# EAGLE design Doorbell (EAGLE 9.6.2)
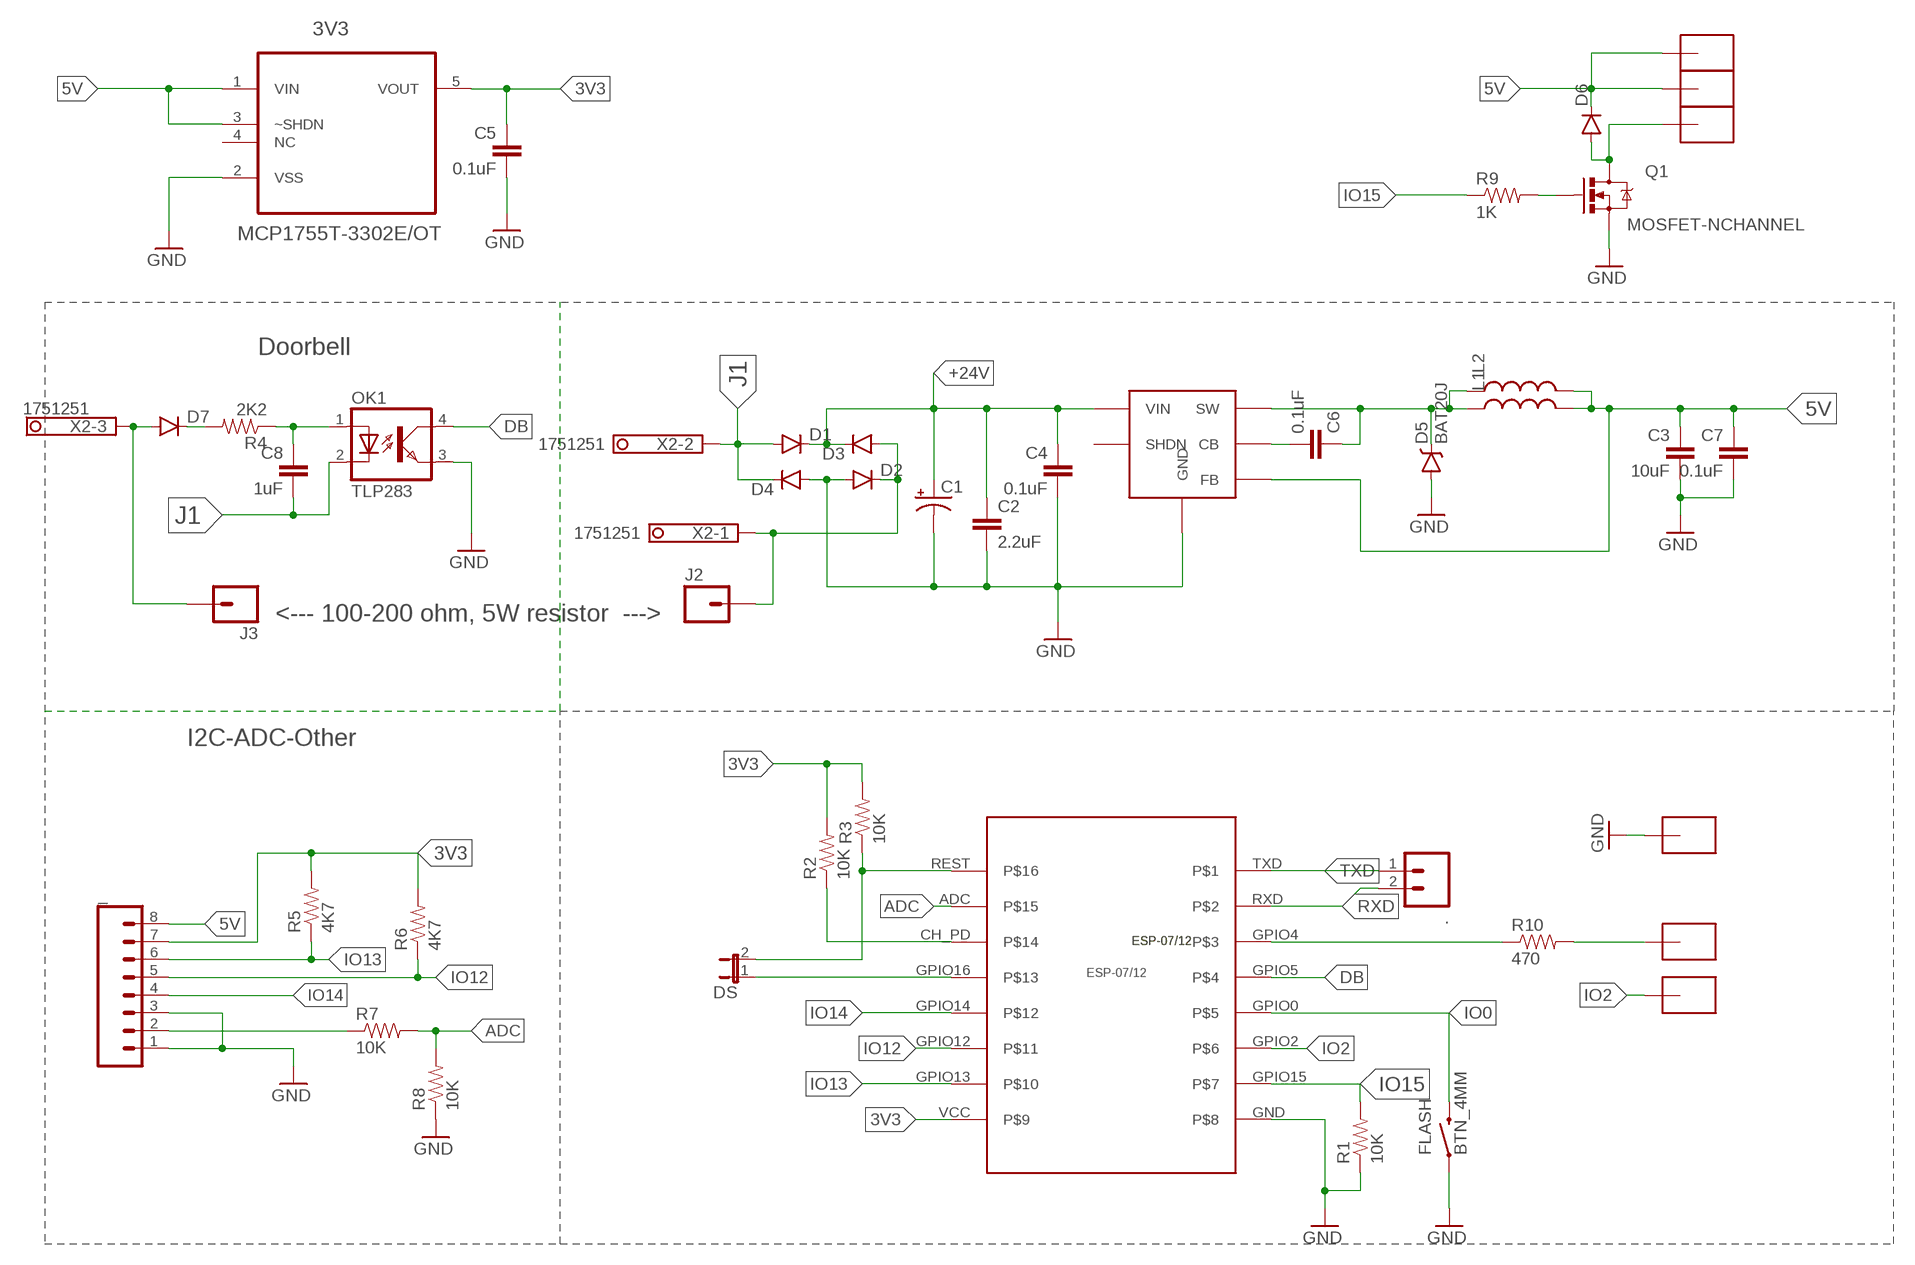
[diagram p0: schematic, sheet 1]

## Parts
3V3  MCP1755T-3302E/OT  MCP1801T-3302I/OT  [SOT95P270X145-5N]
.  M02PTH  [1X02]
_  M08SILK_FEMALE_PTH  [1X08]
C1  CAP_POLPTH4  [CPOL-RADIAL-1000UF-25V]
C2  2.2uF  CAP1206  [1206]
C3  10uF  CAP  [0805-CAP]
C4  0.1uF  CAP  [0805-CAP]
C5  0.1uF  CAP  [0805-CAP]
C6  0.1uF  CAP  [0805-CAP]
C7  0.1uF  CAP  [0805-CAP]
C8  1uF  CAP  [0805-CAP]
D1  DIODESOD123  [SOD-123]
D2  DIODESOD123  [SOD-123]
D3  DIODESOD123  [SOD-123]
D4  DIODESOD123  [SOD-123]
D5  BAT20J  DIODE-SCHOTTKY-BAT20J  [SOD-323]
D6  DIODESOD123  [SOD-123]
D7  DIODESOD123  [SOD-123]
DS  JUMPER-2SMD-NO  [SJ_2S-NO]
FLASH  BTN_4MM  [BTN_4MM]
J2  M01SMDNS  [1X01NS]
J3  M01SMDNS  [1X01NS]
L1  INDUCTOR0805  [0805]
L2  INDUCTOR0805  [0805]
OK1  TLP283  [MINI-FLAT-4]
Q1  MOSFET-NCHANNEL  MOSFET-NCHANNELAO3404A  [SOT23-3]
R1  10K  RESISTOR0805-RES  [0805]
R2  10K  RESISTOR0805-RES  [0805]
R3  10K  RESISTOR0805-RES  [0805]
R4  2K2  RESISTOR0805-RES  [0805]
R5  4K7  RESISTOR0805-RES  [0805]
R6  4K7  RESISTOR0805-RES  [0805]
R7  10K  RESISTOR0805-RES  [0805]
R8  10K  RESISTOR0805-RES  [0805]
R9  1K  RESISTOR0805-RES  [0805]
R10  470  RESISTOR0805-RES  [0805]
U$1  ESP-07/12  [ESP-07/12]
U$2  SMD-PAD-SM  [SMD-PAD3]
U$3  SMD-PAD-SM  [SMD-PAD3]
U$4  SMD-PAD-SM  [SMD-PAD3]
U$5  SMD-PAD-SM  [SMD-PAD3]
U$6  SMD-PAD-SM  [SMD-PAD3]
U$7  SMD-PAD-SM  [SMD-PAD3]
VREG  LMR16006YQ5DDCRQ1  LMR16006YQ  [SOT-23-6]
X2  1751251  [1751251]

## Nets
3V3: 3V3.5(VOUT) _.7 C5.1 R2.2 R3.2 R5.2 R6.2 U$1.VCC
5V: 3V3.1(VIN) 3V3.3(~SHDN) _.8 C3.1 C7.1 D6.C L1.2 L2.2 U$3.P$1 U$7.P$1 VREG.3(FB)
+24V: C1.+ C2.1 C4.1 D1.C D3.C VREG.5(VIN)
ADC: R7.2 R8.2 U$1.ADC
DB: OK1.4(COL) U$1.GPIO5
GND: 3V3.2(VSS) _.1 _.3 C1.- C2.2 C3.2 C4.2 C5.2 C7.2 D2.A D4.A D5.A FLASH.1 OK1.3(EMIT) Q1.2(S) R1.1 R8.1 U$1.GND U$4.P$1 VREG.2(GND)
ICSPCLK: DS.2 R3.1 U$1.REST
IO0: FLASH.2 U$1.GPIO0
IO2: U$1.GPIO2 U$5.P$1
IO12: _.5 R6.1 U$1.GPIO12
IO13: _.6 R5.1 U$1.GPIO13
IO14: _.4 U$1.GPIO14
IO15: R1.2 R9.1 U$1.GPIO15
IO16: DS.1 U$1.GPIO16
J1: C8.2 D1.A D4.C OK1.2(C) X2.2
N$1: D6.A Q1.3(D) U$6.P$1
N$2: C8.1 OK1.1(A) R4.1
N$3: D2.C D3.A J2.1 X2.1
N$4: _.2 R7.1
N$5: D7.A J3.1 X2.3
N$6: R10.1 U$1.GPIO4
N$7: C6.1 D5.C L1.1 L2.1 VREG.6(SW)
N$8: Q1.1(G) R9.2
N$10: C6.2 VREG.1(CB)
N$11: R2.1 U$1.CH_PD
N$12: R10.2 U$2.P$1
N$13: D7.C R4.2
RXD: ..2 U$1.RXD
TXD: ..1 U$1.TXD
Unconnected: 3V3.4(NC) VREG.4(SHDN)

## Notes on the sheet
- Doorbell
- <--- 100-200 ohm, 5W resistor  --->
- I2C-ADC-Other

## Library data of the parts
3V3 = Microchip_By_element14_Batch_1:MCP1801T-3302I/OT: Low Quiescent Current LDO; MPN: MCP1801T-3302I/OT; OC_FARNELL: 1578370; OC_NEWARK: 54M4830; PACKAGE: SOT-5; SUPPLIER: Microchip
. = SparkFun-Connectors:M02: Standard 2-pin 0.1" header. Use with - straight break away headers ( PRT-00116) - right angle break away headers (PRT-00553) - swiss pins (PRT-00743) - machine pins (PRT-00117) - female headers (PRT-00115) Molex polarized connector foot print use with: PRT-08233 with associated crimp pins and housings. 2.54_SCREWTERM for use with PRT-10571. 3.5mm Screw Terminal footprints for PRT-08084 5mm Screw Terminal footprints for use with PRT-08432
_ = SparkFun-Connectors:M08: Header 8 Standard 8-pin 0.1" header. Use with straight break away headers (SKU : PRT-00116), right angle break away headers (PRT-00553), swiss pins (PRT-00743), machine pins (PRT-00117), and female headers (PRT-00115).; PROD_ID: CONN-08438
C1 = SparkFun-Capacitors:CAP_POL: Capacitor Polarized These are standard SMD and PTH capacitors. Normally 10uF, 47uF, and 100uF in electrolytic and tantalum varieties. Always verify the external diameter of the through hole cap, it varies with capacity, voltage, and manufacturer. The EIA devices should be standard.
C2 = SparkFun-Passives:CAP: Capacitor Standard 0603 ceramic capacitor, and 0.1" leaded capacitor.
C3-C8 = SparkFun-Capacitors:CAP: Capacitor Standard 0603 ceramic capacitor, and 0.1" leaded capacitor.
D1-D4 D6 D7 = SparkFun-DiscreteSemi:DIODE: Diode These are standard reverse protection diodes and small signal diodes. SMA package can handle up to about 1A. SOD-323 can handle about 200mA. What the SOD-323 package when ordering, there are some mfgs out there that are 5-pin packages.
D5 = SparkFun-DiscreteSemi:DIODE-SCHOTTKY: Schottky diodes in SFE's production catalog BAT20J 1A 23V 0.62Vf RB751 120mA 40V 0.37Vf PMEG4005EJ 0.5A 40V 0.42Vf MBRA140 1A 40V 0.5Vf B340A 3A 40V SMA; PROD_ID: DIO-11623
DS = SparkFun-Retired:JUMPER-2: Jumper Basic 0.1" spaced jumper. Use with breakaway headers.
FLASH = CuriousTech:BTN_4MM
J2 J3 = SparkFun-Connectors:M01: Header 1 Standard 1-pin 0.1" header. Use with straight break away headers (SKU : PRT-00116), right angle break away headers (PRT-00553), swiss pins (PRT-00743), machine pins (PRT-00117), and female headers (PRT-00115). SMTSO-256-ET is a "flush mount" nut for a 4-40 screw. The older package used to be too tight, and did not allow it to sit properly thru the drill hit. The latest (0.165DIA) fits nice and snug.
L1 L2 = SparkFun-Passives:INDUCTOR: Inductors Basic Inductor/Choke - 0603 and 1206. Footprints are not proven and vary greatly between part numbers. INDUCTOR POWER 3.3UH 4.0A SMD 0.197" L x 0.197" W x 0.177" H (5.00mm x 5.00mm x 4.50mm)
OK1 = optocoupler:TLP283: TOSHIBA PHOTOCOUPLER GaAs IRED & PHOTO-TRANSISTOR Source: http://www.semicon.toshiba.co.jp/td/en/Opto/Photocoupler/en_20050928_TLP283_datasheet.pdf; OC_FARNELL: unknown; OC_NEWARK: unknown
Q1 = SparkFun-DiscreteSemi:MOSFET-NCHANNEL: Common NMOSFET Parts MFG P/N Store ID Prod ID FDD8780 TRANS-09984 SI7820DN TRANS-11055 FDS6630A IC-08089 2N7002PW TRANS-11151 FQP30N06L COM-10213 TRANS-10060 BSS123LT1G TRANS-08345 BSS138 TRANS-00830 BS170 2N7000; PROD_ID: TRAN-12988
R1-R10 = SparkFun-Resistors:RESISTOR: Resistor Basic schematic elements and footprints for 0603, 1206, and PTH resistors.
U$1 = ESP-07_12:ESP-07/12: Version 1.0 of the library for the ESP-07/12 full GPIO dev board module byME Jon jonnyradu@gmail.com
U$2-U$7 = CuriousTech:SMD-PAD-SM: SMD-PAD
VREG = CuriousTech:LMR16006YQ
X2 = con-phoenix-350:1751251: MKDS 1/ 3-3,5 Printklemme Nennstrom: 10 A Bemessungsspannung: 160 V Raster: 3,5 mm Polzahl: 3 Montageart: Löten Anschlussart: Schraubanschluss Anschlussrichtung vom Leiter zur Platine: 0° Source: http://eshop.phoenixcontact.com .. 1751251.pdf; OC_FARNELL: unknown; OC_NEWARK: unknown

## Board
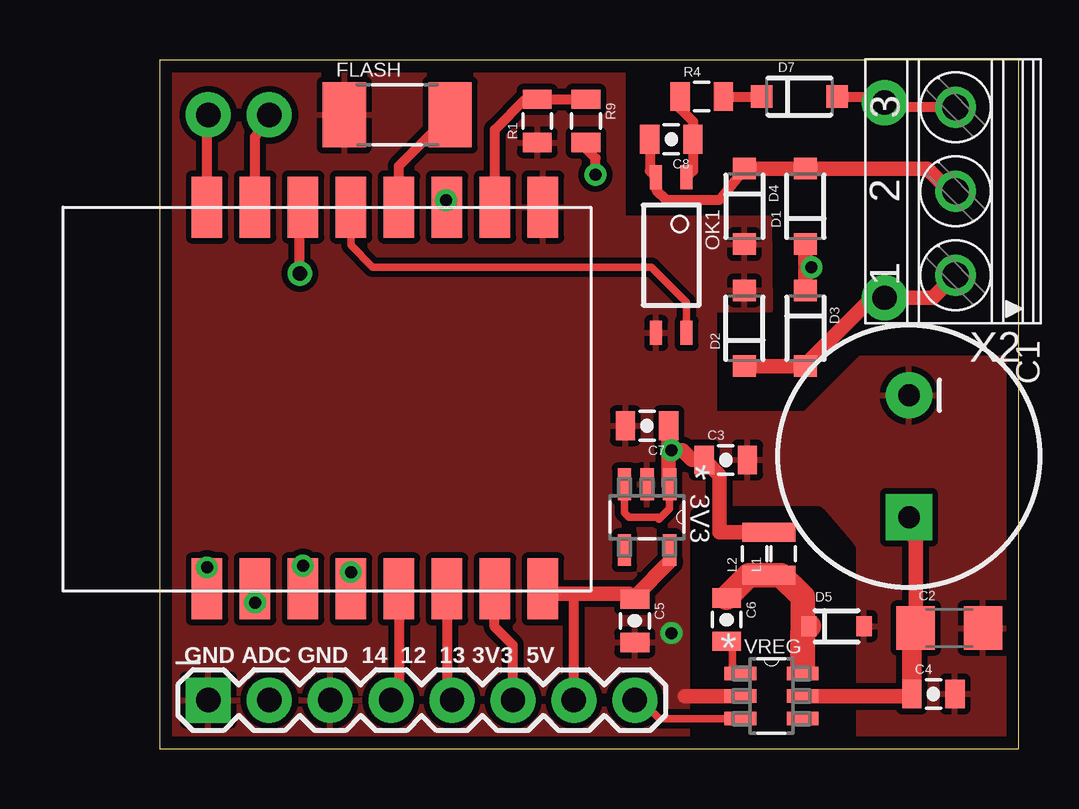
[diagram p1: board, top side]
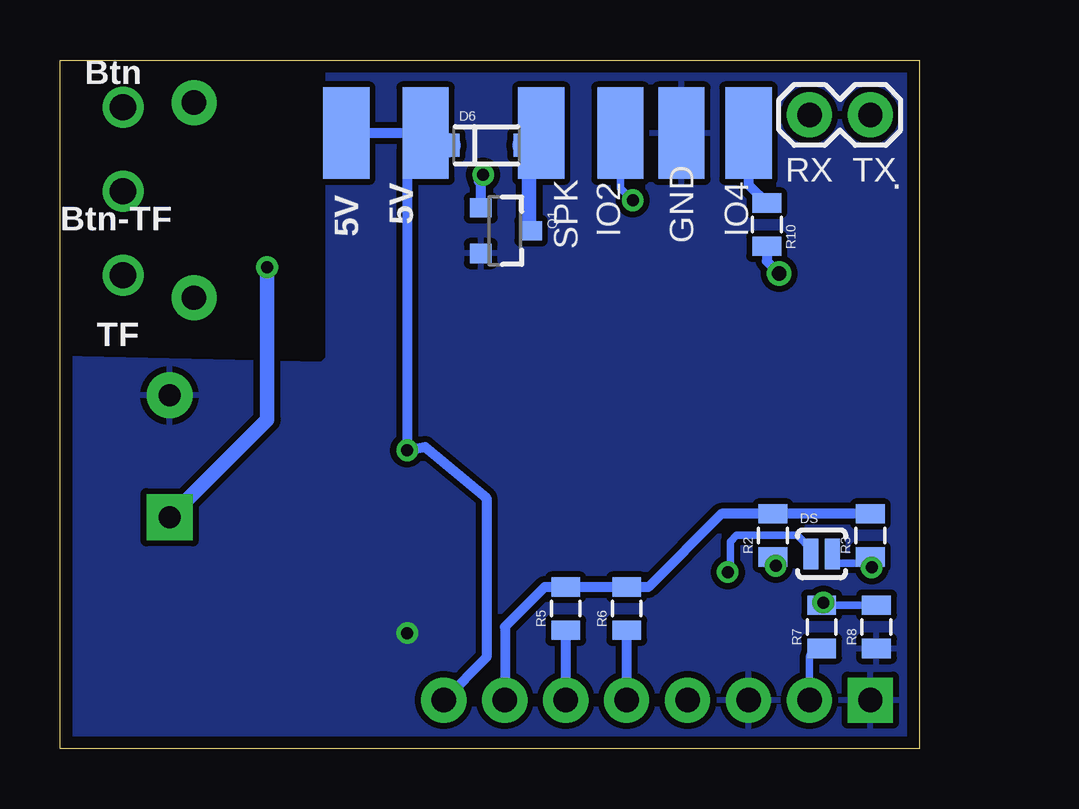
[diagram p2: board, bottom side, seen from below]

Size 35.81 x 28.7 mm. Coordinates in mm from the lower left corner, seen from the top.
Outline: 35.81,0 35.81,28.7 0,28.7 0,0 35.81,0
Copper layers (1*16): Top 0.035mm / dielectric 1.5mm / Bottom 0.035mm
Design rules "default *": minimum track width 10mil, minimum drill 24mil, track to track 8mil, track to pad 8mil, pad to pad 8mil, via to via 8mil, smd to smd 8mil, copper to edge 20mil, drill to drill 8mil, minimum pad ring 10mil, minimum via ring 8mil, stop-mask expansion 4mil, vias tented up to drill 0mil, thermal gap 10mil
tRestrict: area 22.5,0.5 to 28.6,9.7

### Footprints (pad centres in the part's own frame; a part is rotated, then mirrored left to right if it is on the bottom)
SOT95P270X145-5N = smd 1.321 x 0.559: 1 -1.372,0.94; 2 -1.372,0; 3 -1.372,-0.94; 4 1.372,-0.94; 5 1.372,0.94
1X02 = drill 1.016 pad 1.88: 1 0,0; 2 2.54,0
1X08 = drill 1.016 pad 1.88 square: 1 0,0 | drill 1.016 pad 1.88: 2 2.54,0; 3 5.08,0; 4 7.62,0; 5 10.16,0; 6 12.7,0; 7 15.24,0; 8 17.78,0
CPOL-RADIAL-1000UF-25V = drill 0.9 pad 1.93 square: + 2.54,0 | drill 0.9 pad 1.93: - -2.54,0
1206 = smd 1.6 x 1.8: 1 -1.4,0; 2 1.4,0
0805-CAP = smd 0.8 x 1.2: 1 -0.9,0; 2 0.9,0
SOD-123 = smd 0.9 x 0.95: A 1.575,0; C -1.575,0
SOD-323 = smd 0.63 x 0.83: A 1.15,0; C -1.15,0
SJ_2S-NO = smd 0.635 x 1.27: 1 -0.45,0; 2 0.45,0
BTN_4MM = smd 1.8 x 2.7: 1 -2.2,0; 2 2.2,0
1X01NS = drill 1.016 pad 1.88: 1 0,0
0805 = smd 0.8 x 1.2: 1 -0.9,0; 2 0.9,0
MINI-FLAT-4 = smd 1 x 0.5: 1 -3.24,0.635; 2 -3.24,-0.635; 3 3.24,-0.635; 4 3.24,0.635
SOT23-3 = smd 0.8 x 0.9: 1 -0.95,-1; 2 0.95,-1; 3 0,1.1
ESP-07/12 = smd 2.54 x 1.27: ADC 0.1,14; CH_PD 0.1,12; GND 16,2; GPIO0 16,8; GPIO2 16,6; GPIO4 16,12; GPIO5 16,10; GPIO12 0.1,6; GPIO13 0.1,4; GPIO14 0.1,8; GPIO15 16,4; GPIO16 0.1,10; REST 0.1,16; RXD 16,14; TXD 16,16; VCC 0.1,2
SMD-PAD3 = smd 3.81 x 1.93: P$1 0,0
SOT-23-6 = smd 1.321 x 0.559: 1 -1.295,0.94; 2 -1.295,0; 3 -1.295,-0.94; 4 1.295,-0.94; 5 1.295,0; 6 1.295,0.94
1751251 = drill 1.1 pad 1.7: 1 -3.5,-0.1; 2 0,-0.1; 3 3.5,-0.1

### Placement (x,y rotation side)
3V3  20.32,9.65 270 top
.  2.03,26.42 180 bottom
_  2.03,2.03 0 top
C1  31.24,12.19 270 top
C2  32.92,5.03 0 top
C3  23.6,12.04 0 top
C4  32.26,2.29 0 top
C5  19.81,5.33 270 top
C6  23.64,5.39 270 top
C7  20.32,13.46 180 top
C8  21.34,25.4 180 top
D1  26.92,22.61 90 top
D2  24.38,17.53 90 top
D3  26.92,17.53 270 top
D4  24.38,22.61 270 top
D5  28.22,5.11 0 top
D6  18.03,25.15 0 bottom
D7  26.67,27.18 0 top
DS  4.06,8.13 0 bottom
FLASH  9.91,26.42 0 top
J2  30.23,18.8 0 top
J3  30.23,26.92 0 top
L1  25.91,8.13 90 top
L2  24.89,8.13 90 top
OK1  21.34,20.57 270 top
Q1  17.27,21.59 270 bottom
R1  15.75,26.16 90 top
R2  6.1,8.89 90 bottom
R3  2.03,8.89 90 bottom
R4  22.61,27.18 0 top
R5  14.73,5.84 90 bottom
R6  12.19,5.84 90 bottom
R7  4.06,5.08 90 bottom
R8  1.78,5.08 90 bottom
R9  17.78,26.16 270 top
R10  6.35,21.84 90 bottom
U$1  17.98,6.57 90 top
U$2  7.11,25.65 270 bottom
U$3  23.88,25.65 270 bottom
U$4  9.91,25.65 270 bottom
U$5  12.45,25.65 90 bottom
U$6  15.75,25.65 270 bottom
U$7  20.57,25.65 90 bottom
VREG  25.51,2.2 0 top
X2  33.08,23.23 90 top

### Tracks (layer width: path | path; a pad name or v marks a point on that pad's centre or on a via)
3V3
  Top 0.406: U$1.VCC 16.23,6.41 17.27,6.41 _.7 | 3V3.5 21.26,7.79 | 19.56,6.47 19.58,6.47 C5.1 19.81,6.34
  Top 0.61: 19.81,6.21 19.81,6.34 21.26,7.79 | 19.56,6.47 16.18,6.47 U$1.VCC
  Bottom 0.406: R3.2 R2.2 8.24,9.79 11.29,6.74 R6.2 R5.2 15.61,6.74 17.27,5.08 _.7
5V  (via drill 0.5)
  Top 0.305: 3V3.1 21.26,10.92 21.26,10.01 20.83,9.58 20.83,9.65 19.56,9.65 19.38,9.83 3V3.3 | VREG.3 20.84,1.26 20.07,2.03 _.8
  Top 0.406: 21.79,12.45 21.22,12.45 C7.1 21.34,13.35 v21.34,12.45 | 21.22,10.96 21.26,10.92
  Top 0.61: L2.2 23.33,9.03 23.33,11.41 C3.1 22.2,12.04 21.79,12.45 | C7.1 21.22,10.96
  Top 0.813: L1.2 L2.2
  Bottom 0.406: _.8 18.03,3.81 18.03,10.46 20.59,12.58 v21.34,12.45 21.34,24.89 U$7.P$1 U$3.P$1
  Bottom 1.016: U$7.P$1 20.07,25.15 D6.C
+24V  (via drill 0.5)
  Top 0.61: 26.92,20.07 D3.C | VREG.5 31.27,2.2 C4.1 | 31.36,4.57 31.37,4.57 31.37,4.93 C2.1 31.52,8.75 31.08,9.2 30.71,9.65 C1.+ | v27.18,20.07 26.92,20.07 | 26.92,20.07 D1.C
  Top 0.813: 31.36,4.57 C4.1
  Bottom 0.61: C1.+ 27.18,13.72 v27.18,20.07
ADC  (via drill 0.5)
  Top 0.305: v3.99,6.1 4.32,6.33 U$1.ADC
  Bottom 0.305: R8.2 R7.2 v3.99,6.1
DB
  Top 0.305: U$1.GPIO5 7.98,20.98 8.89,20.07 20.51,20.07 21.97,18.6 OK1.4
GND  (via drill 0.5)
  Top 0.61: VREG.2 21.91,2.2
  other vias: 21.34,4.83
  pour Top (isolate 0.254): 0,0 0,28.7 19.3,28.7 19.3,22.1 25.4,22.1 25.44,18.27 23.11,18.29 23.11,13.97 26.92,13.97 29.23,16.27 35.13,16.27 35.83,15.99 35.83,0
  pour Bottom (isolate 0.254): 35.81,0 0.25,0 0.25,28.45 24.64,28.45 24.64,16.26 24.89,16 35.81,16.26
ICSPCLK  (via drill 0.5)
  Top 0.305: U$1.REST v1.98,7.56
  Bottom 0.305: v1.98,7.56 R3.1 2.29,7.74 3.61,7.74 DS.2
IO0
  Top 0.406: U$1.GPIO0 9.98,24.29 FLASH.2
IO2  (via drill 0.5)
  Top 0.305: v11.94,22.86 11.94,23.04 U$1.GPIO2
  Bottom 0.305: U$5.P$1 12.45,23.37 v11.94,22.86
IO12
  Top 0.406: U$1.GPIO12 11.98,2.25 _.5
  Bottom 0.406: R6.1 _.5
IO13
  Top 0.406: U$1.GPIO13 13.97,5.08 14.73,4.32 _.6
  Bottom 0.406: R5.1 _.6
IO14
  Top 0.406: U$1.GPIO14 9.98,2.36 _.4
IO15
  Top 0.406: U$1.GPIO15 13.98,25.8 15.24,27.06 R1.2 R9.1
IO16  (via drill 0.5)
  Top 0.305: v7.98,7.37 7.87,6.82 U$1.GPIO16
  Bottom 0.305: DS.1 4.51,8.32 5.08,8.89 7.62,8.89 7.87,8.64 7.87,7.62 v7.98,7.37
J1
  Top 0.406: D4.C 23.33,22.86 21.15,22.86 20.7,23.31 OK1.2 20.44,24.08 C8.2
  Top 0.61: X2.2 32.95,23.23 32,24.18 D1.A D4.C
N$1
  Bottom 0.61: U$6.P$1 16.26,25.15 16.26,21.67 Q1.3
  Bottom 1.016: D6.A 15.95,25.65 U$6.P$1
N$2
  Top 0.406: R4.1 21.71,26.67 22.24,26.14 C8.1 22.24,24.08 OK1.1
N$3
  Top 0.61: X2.1 32.24,18.8 J2.1 29.72,18.8 26.92,16 D3.A D2.C
N$4
  Bottom 0.305: R7.1 4.46,4.18 4.57,3.81 _.2
N$5
  Top 0.406: X2.3 30.23,26.73 J3.1 | J3.1 30.23,27.18 29.97,27.18 | D7.A 29.97,27.18 | 29.97,27.18 J3.1
N$6  (via drill 0.61)
  Top 0.406: v5.84,19.81 5.84,22.43 U$1.GPIO4
  Bottom 0.406: R10.1 6.35,20.32 v5.84,19.81
N$7
  Top 0.61: VREG.6 26.8,3.34 26.81,3.35
  Top 1.016: L2.1 L1.1 26.81,6.33 26.81,3.35 | C6.1 24.58,7.23 L2.1 | D5.C 26.8,4.84 26.8,3.34 | L2.1 25.19,7.23
N$8  (via drill 0.5)
  Top 0.406: v18.17,23.93 18.17,24.62 17.65,25.14 R9.2
  Bottom 0.406: Q1.1 18.27,23.56 18.36,23.65 v18.17,23.93
N$10
  Top 0.305: 23.88,4.49 23.88,3.47 VREG.1
  Top 0.406: C6.2 23.88,4.49
N$11  (via drill 0.5)
  Top 0.305: U$1.CH_PD v5.98,7.62
  Bottom 0.305: v5.98,7.62 R2.1
N$12
  Bottom 0.406: U$2.P$1 7.11,23.51 R10.2
N$13
  Top 0.406: R4.2 D7.C
RXD
  Top 0.406: U$1.RXD 3.98,25.49 ..2
TXD
  Top 0.406: U$1.TXD 1.98,25.46 2.03,25.91 ..1

### Text on the board
tPlace: GND ADC GND 14 12 13 3V3 5V
bPlace: Btn | RX TX | 5V | Btn-TF | IO4 | GND | IO2 | SPK | 5V | TF
tStop: ESP-07
bStop: CuriousTech.net